# Altium schematic sheet Capstone_Signal_Conditioners_Subsystem_Test_Schematic.SchDoc
size A; SheetNumber: 1; SheetTotal: 5
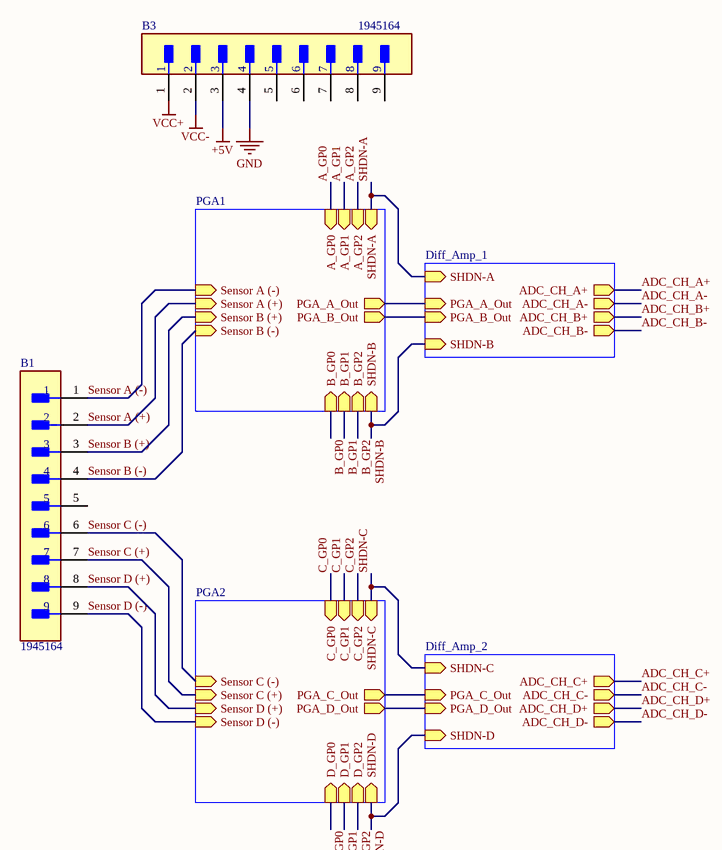
[diagram p0: Capstone_Signal_Conditioners_Subsystem_Test_Schematic.SchDoc]

## Parts
B1  1945164  [FP-4-644456-0-MFG]
B3  1945164  [FP-4-644456-0-MFG]

## Sub-sheets
Diff_Amp_1 = LTC6362_Schematic.SchDoc: PGA_A_Out (in), PGA_B_Out (in), SHDN-A (in), SHDN-B (in), ADC_CH_A+ (out), ADC_CH_A- (out), ADC_CH_B- (out), ADC_CH_B+ (out)
Diff_Amp_2 = LTC6362_Schematic_2.SchDoc: SHDN-C (in), SHDN-D (in), ADC_CH_D- (out), ADC_CH_D+ (out), ADC_CH_C- (out), ADC_CH_C+ (out), PGA_C_Out (in), PGA_D_Out (in)
PGA1 = THS7002CPWP_Schematic.SchDoc: Sensor A (+) (in), Sensor A (-) (in), Sensor B (+) (in), Sensor B (-) (in), A_GP0 (in), A_GP1 (in), A_GP2 (in), PGA_A_Out (out), PGA_B_Out (out), B_GP0 (in), B_GP1 (in), B_GP2 (in), SHDN-A (in), SHDN-B (in)
PGA2 = THS7002CPWP_Schematic_2.SchDoc: Sensor C (+) (in), Sensor C (-) (in), Sensor D (+) (in), Sensor D (-) (in), C_GP0 (in), D_GP0 (in), C_GP1 (in), C_GP2 (in), D_GP1 (in), D_GP2 (in), SHDN-C (in), SHDN-D (in), PGA_C_Out (out), PGA_D_Out (out)

## Nets
+5V: B3.3
GND: B3.4
VCC+: B3.1
VCC-: B3.2
A_GP0: sheet PGA1/A_GP0
A_GP1: sheet PGA1/A_GP1
A_GP2: sheet PGA1/A_GP2
ADC_CH_A+: sheet Diff_Amp_1/ADC_CH_A+
ADC_CH_A-: sheet Diff_Amp_1/ADC_CH_A-
ADC_CH_B+: sheet Diff_Amp_1/ADC_CH_B+
ADC_CH_B-: sheet Diff_Amp_1/ADC_CH_B-
ADC_CH_C+: sheet Diff_Amp_2/ADC_CH_C+
ADC_CH_C-: sheet Diff_Amp_2/ADC_CH_C-
ADC_CH_D+: sheet Diff_Amp_2/ADC_CH_D+
ADC_CH_D-: sheet Diff_Amp_2/ADC_CH_D-
B_GP0: sheet PGA1/B_GP0
B_GP1: sheet PGA1/B_GP1
B_GP2: sheet PGA1/B_GP2
C_GP0: sheet PGA2/C_GP0
C_GP1: sheet PGA2/C_GP1
C_GP2: sheet PGA2/C_GP2
D_GP0: sheet PGA2/D_GP0
D_GP1: sheet PGA2/D_GP1
D_GP2: sheet PGA2/D_GP2
Sensor A (+): B1.2 ; sheet PGA1/Sensor A (+)
Sensor A (-): B1.1 ; sheet PGA1/Sensor A (-)
Sensor B (+): B1.3 ; sheet PGA1/Sensor B (+)
Sensor B (-): B1.4 ; sheet PGA1/Sensor B (-)
Sensor C (+): B1.7 ; sheet PGA2/Sensor C (+)
Sensor C (-): B1.6 ; sheet PGA2/Sensor C (-)
Sensor D (+): B1.8 ; sheet PGA2/Sensor D (+)
Sensor D (-): B1.9 ; sheet PGA2/Sensor D (-)
SHDN-A: sheet PGA1/SHDN-A, sheet Diff_Amp_1/SHDN-A
SHDN-B: sheet PGA1/SHDN-B, sheet Diff_Amp_1/SHDN-B
SHDN-C: sheet PGA2/SHDN-C, sheet Diff_Amp_2/SHDN-C
SHDN-D: sheet PGA2/SHDN-D, sheet Diff_Amp_2/SHDN-D
(unnamed): sheet PGA1/PGA_A_Out, sheet Diff_Amp_1/PGA_A_Out
(unnamed): sheet PGA1/PGA_B_Out, sheet Diff_Amp_1/PGA_B_Out
(unnamed): sheet PGA2/PGA_C_Out, sheet Diff_Amp_2/PGA_C_Out
(unnamed): sheet PGA2/PGA_D_Out, sheet Diff_Amp_2/PGA_D_Out

Not connected (* = marked no-connect by the designer): B1 5; B3 5 6 7 8 9

## Library data of the parts
B1 B3 = CMP-03369-000038-1: CONN HEADER VERT 9POS 3.5MM; Manufacturer Part Number: 4-644456-0; Manufacturer: TE Connectivity; Pitch: 2.54mm; Current Rating: 5A; Conn Gender: Male; Number Of Contacts: 10; Conn Orientation: Vertical; Voltage Rating: 250V; Number Of Rows: 1; Device Class L3: unset; Octopart: https://octopart.com/4-644456-0-te+connectivity-39514173; Mouser Description: Headers & Wire Housings NARROW FLT HDR 10P Straight Post; ComponentLink2Description: Datasheet; Height: 0.408inch; Package: 4-644456-0; RoHS: TRUE; Temperature Range High: +105°C; Digikey Description: CONN HEADER VERT 10POS 2.54MM; Temperature: -55°C to +105°C; Device Class L2: Headers and Wire Housings; Automotive: No; Lead Free: Yes; Contact Material: Tin; Temperature Range Low: -55°C; Footprint Url: https://www.te.com/commerce/DocumentDelivery/DDEController?Action=showdoc&DocId=Customer+Drawing%7F644456%7FD2%7Fpdf%7FEnglish%7FENG_CD_644456_D2.pdf%7F4-644456-0; Device Class L1: Connectors; Category: Conn; ComponentLink2URL: https://www.te.com/commerce/DocumentDelivery/DDEController?Action=showdoc&DocId=Data+Sheet%7F82056_MTA%7F0818%7Fpdf%7FEnglish%7FENG_DS_82056_MTA_0818.pdf%7F4-644456-0